# EAGLE design Digital In (EAGLE 5.11)
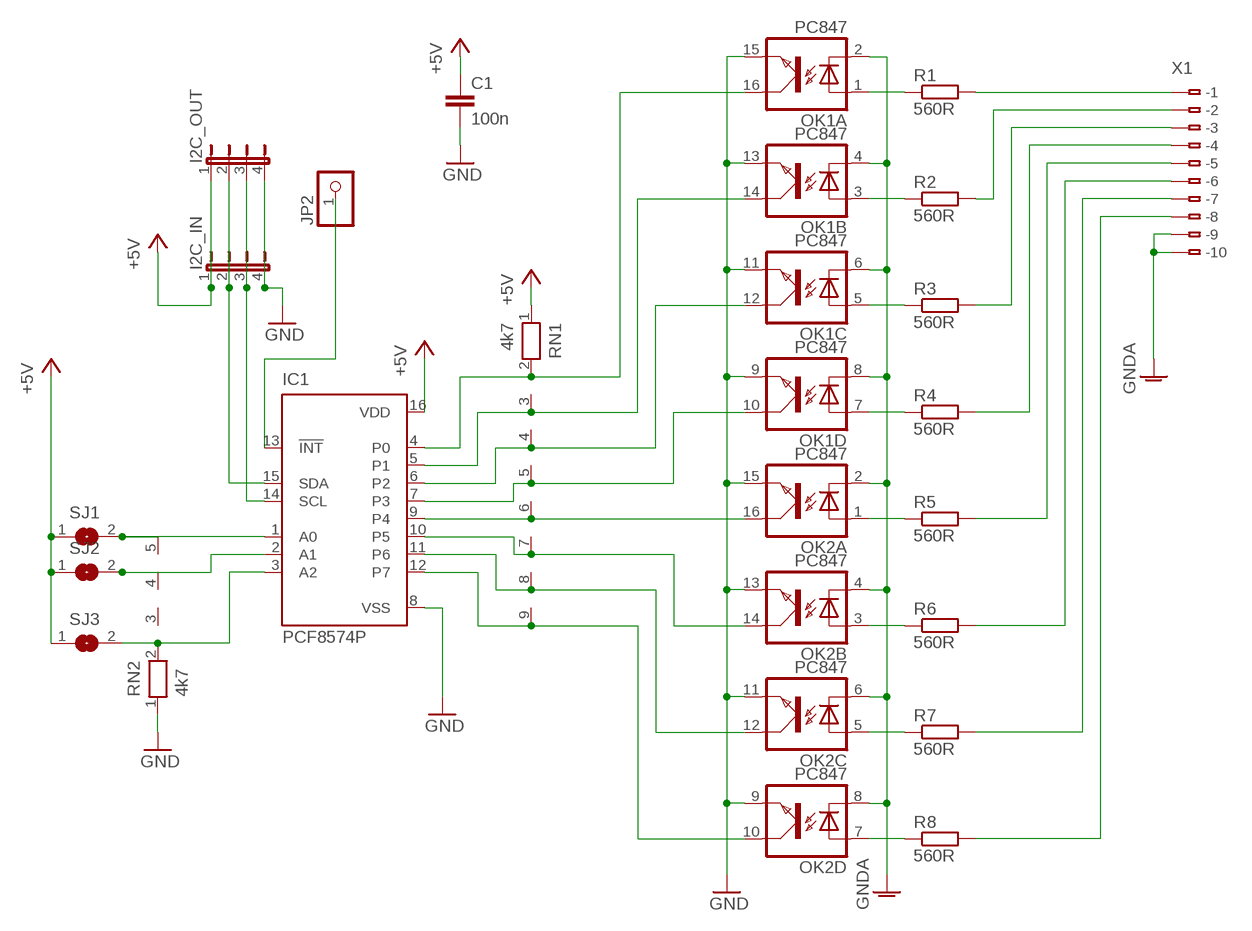
[diagram p0: schematic, sheet 1]

## Parts
C1  100n  C-EU050-030X075  [C050-030X075]
I2C_IN  JP4E  [JP4]
I2C_OUT  JP4E  [JP4]
IC1  PCF8574P  [DIL16]
JP2  PINHD-1X1  [1X01]
OK1  PC847  [DIL16]
OK2  PC847  [DIL16]
R1  560R  R-EU_0207/10  [0207/10]
R2  560R  R-EU_0207/10  [0207/10]
R3  560R  R-EU_0207/10  [0207/10]
R4  560R  R-EU_0207/10  [0207/10]
R5  560R  R-EU_0207/10  [0207/10]
R6  560R  R-EU_0207/10  [0207/10]
R7  560R  R-EU_0207/10  [0207/10]
R8  560R  R-EU_0207/10  [0207/10]
RN1  4k7  RN08  [RN-9]
RN2  4k7  RN04  [RN-5]
SJ1  SJW  [SJW]
SJ2  SJW  [SJW]
SJ3  SJW  [SJW]
X1  250-210  [250-210]

## Nets
+5V: C1.1 I2C_IN.1 I2C_OUT.1 IC1.16(VDD) RN1.1 SJ1.1 SJ2.1 SJ3.1
GND: C1.2 I2C_IN.4 I2C_OUT.4 IC1.8(VSS) OK1.9(D:EMIT) OK1.11(C:EMIT) OK1.13(B:EMIT) OK1.15(A:EMIT) OK2.9(D:EMIT) OK2.11(C:EMIT) OK2.13(B:EMIT) OK2.15(A:EMIT) RN2.1
GNDA: OK1.2(A:C) OK1.4(B:C) OK1.6(C:C) OK1.8(D:C) OK2.2(A:C) OK2.4(B:C) OK2.6(C:C) OK2.8(D:C) X1.A9(-9) X1.B10(-10)
N$1: IC1.9(P4) OK2.16(A:COL) RN1.6
N$2: IC1.7(P3) OK1.10(D:COL) RN1.5
N$3: IC1.6(P2) OK1.12(C:COL) RN1.4
N$4: IC1.5(P1) OK1.14(B:COL) RN1.3
N$5: IC1.4(P0) OK1.16(A:COL) RN1.2
N$6: IC1.10(P5) OK2.14(B:COL) RN1.7
N$7: IC1.11(P6) OK2.12(C:COL) RN1.8
N$8: IC1.12(P7) OK2.10(D:COL) RN1.9
N$9: IC1.13(!INT) JP2.1
N$10: IC1.3(A2) RN2.2 SJ3.2
N$11: IC1.2(A1) RN2.4 SJ2.2
N$12: IC1.1(A0) RN2.5 SJ1.2
N$14: I2C_IN.2 I2C_OUT.2 IC1.15(SDA)
N$15: I2C_IN.3 I2C_OUT.3 IC1.14(SCL)
N$16: OK1.1(A:A) R1.1
N$17: OK1.3(B:A) R2.1
N$18: OK1.5(C:A) R3.1
N$19: OK1.7(D:A) R4.1
N$20: OK2.1(A:A) R5.1
N$21: OK2.3(B:A) R6.1
N$22: OK2.5(C:A) R7.1
N$23: OK2.7(D:A) R8.1
N$24: R1.2 X1.A1(-1)
N$25: R2.2 X1.B2(-2)
N$26: R3.2 X1.A3(-3)
N$27: R4.2 X1.B4(-4)
N$28: R5.2 X1.A5(-5)
N$29: R6.2 X1.B6(-6)
N$30: R7.2 X1.A7(-7)
N$31: R8.2 X1.B8(-8)
Unconnected: RN2.3

## Library data of the parts
C1 = resistor:C-EU: CAPACITOR, European symbol
I2C_IN I2C_OUT = jumper:JP4E: JUMPER
IC1 = micro-philips:PCF8574: I2C-Bus Remote 8-bit I/O expander http://www.semiconductors.philips.com/acrobat_download/datasheets/PCF8574_4.pdf; MPN: PCF8574PN; OC_FARNELL: 204020; OC_NEWARK: 11N8515
JP2 = pinhead:PINHD-1X1: PIN HEADER
OK1 OK2 = optocoupler:PC847: SHARP OPTO COUPLER; OC_FARNELL: 9707735; OC_NEWARK: unknown
R1-R8 = resistor:R-EU_: RESISTOR, European symbol
RN1 = resistor-net:RN08: RESISTOR NETWORK; OC_FARNELL: unknown; OC_NEWARK: unknown
RN2 = resistor-net:RN04: RESISTOR NETWORK; OC_FARNELL: unknown; OC_NEWARK: unknown
SJ1-SJ3 = jumper:SJ: SMD solder JUMPER
X1 = Benjamin:250-210: WAGO Cage Clamp; MPN: 233-110; OC_FARNELL: unknown; OC_NEWARK: 28K9052

## Board
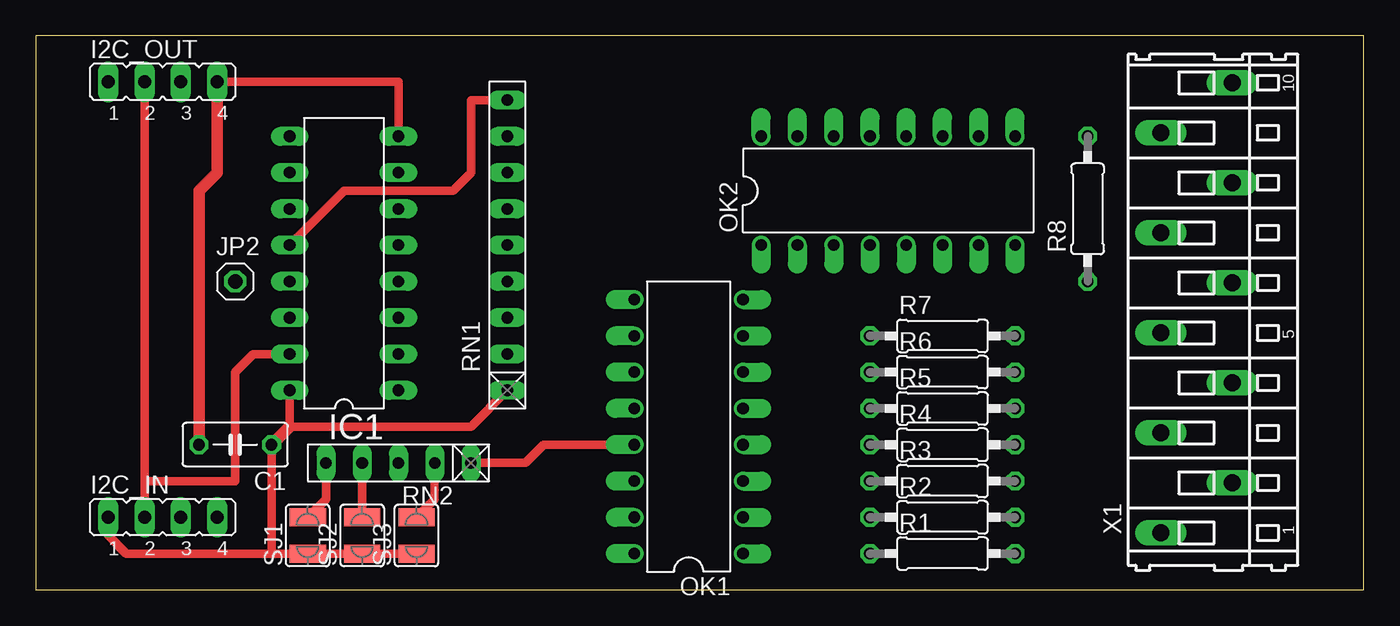
[diagram p1: board, top side]
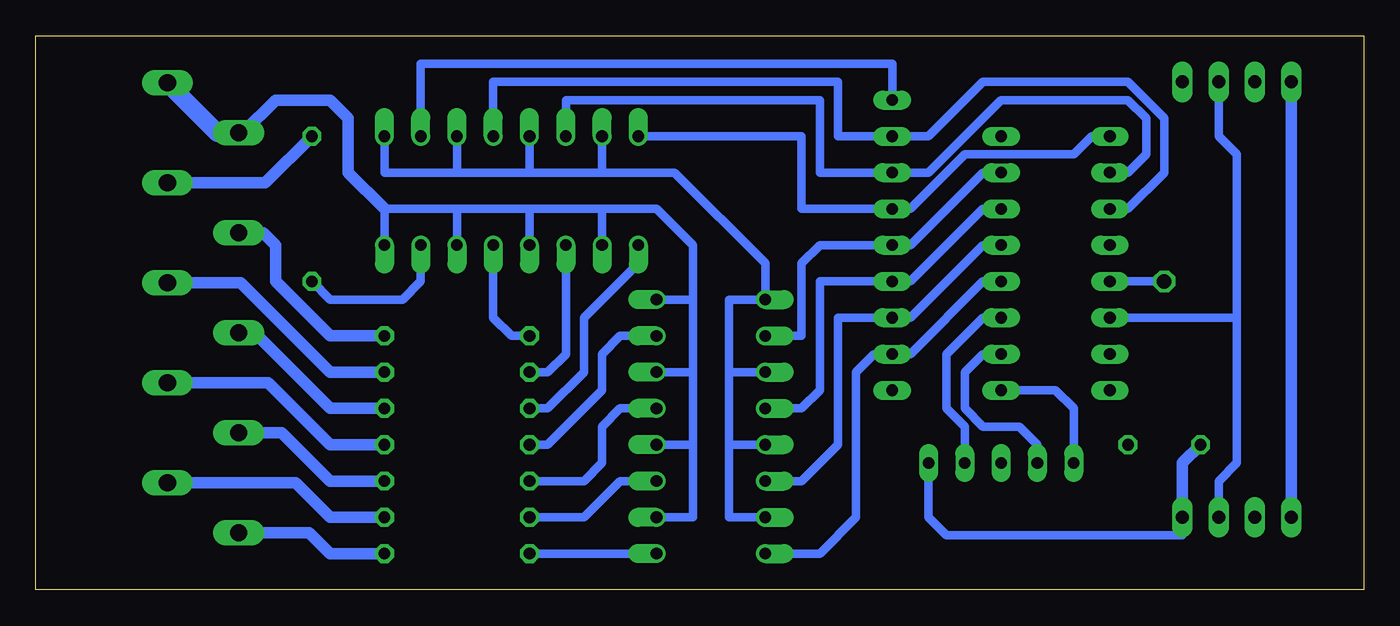
[diagram p2: board, bottom side, seen from below]

Size 93 x 38.79 mm. Coordinates in mm from the lower left corner, seen from the top.
Outline: 0,0 93,0 93,38.79 0,38.79 0,0
Copper layers (1*16): Top 0.035mm / dielectric 1.5mm / Bottom 0.035mm
Design rules "default": minimum track width 10mil, minimum drill 24mil, track to track 8mil, track to pad 8mil, pad to pad 8mil, via to via 8mil, smd to smd 8mil, copper to edge 40mil, drill to drill 8mil, minimum pad ring 10mil, minimum via ring 8mil, stop-mask expansion 4mil, vias tented up to drill 0mil, thermal gap 10mil

### Footprints (pad centres in the part's own frame; a part is rotated, then mirrored left to right if it is on the bottom)
C050-030X075 = drill 0.813 octagon: 1 -2.54,0; 2 2.54,0
JP4 = drill 0.914 long: 1 -3.81,0; 2 -1.27,0; 3 1.27,0; 4 3.81,0
DIL16 = drill 0.813 long: 1 -8.89,-3.81; 2 -6.35,-3.81; 3 -3.81,-3.81; 4 -1.27,-3.81; 5 1.27,-3.81; 6 3.81,-3.81; 7 6.35,-3.81; 8 8.89,-3.81; 9 8.89,3.81; 10 6.35,3.81; 11 3.81,3.81; 12 1.27,3.81; 13 -1.27,3.81; 14 -3.81,3.81; 15 -6.35,3.81; 16 -8.89,3.81
1X01 = drill 1.016 octagon: 1 0,0
DIL16' = drill 0.813 offset: 1 -8.89,-3.81; 2 -6.35,-3.81; 3 -3.81,-3.81; 4 -1.27,-3.81; 5 1.27,-3.81; 6 3.81,-3.81; 7 6.35,-3.81; 8 8.89,-3.81; 9 8.89,3.81; 10 6.35,3.81; 11 3.81,3.81; 12 1.27,3.81; 13 -1.27,3.81; 14 -3.81,3.81; 15 -6.35,3.81; 16 -8.89,3.81
0207/10 = drill 0.813 octagon: 1 -5.08,0; 2 5.08,0
RN-9 = drill 0.813 long: 1 -10.16,0; 2 -7.62,0; 3 -5.08,0; 4 -2.54,0; 5 0,0; 6 2.54,0; 7 5.08,0; 8 7.62,0; 9 10.16,0
RN-5 = drill 0.813 long: 1 -5.08,0; 2 -2.54,0; 3 0,0; 4 2.54,0; 5 5.08,0
SJW = smd 1.27 x 2.54: 1 -1.27,0; 2 1.27,0
250-210 = drill 1.2 long: A1 -11.25,2.5; A3 -4.25,2.5; A5 2.75,2.5; A7 9.75,2.5; A9 16.75,2.5; B2 -7.75,-2.5; B4 -0.75,-2.5; B6 6.25,-2.5; B8 13.25,-2.5; B10 20.25,-2.5

### Placement (x,y rotation side)
C1  13.97,10.16 180 top
I2C_IN  8.89,5.08 0 top
I2C_OUT  8.89,35.56 0 top
IC1  21.59,22.86 90 top
JP2  13.97,21.59 0 top
OK1  PC847  [DIL16']  45.72,11.43 90 top
OK2  PC847  [DIL16']  59.69,27.94 0 top
R1  63.5,2.54 0 top
R2  63.5,5.08 0 top
R3  63.5,7.62 0 top
R4  63.5,10.16 0 top
R5  63.5,12.7 0 top
R6  63.5,15.24 0 top
R7  63.5,17.78 0 top
R8  73.66,26.67 90 top
RN1  33.02,24.13 90 top
RN2  25.4,8.89 180 top
SJ1  19.05,3.81 90 top
SJ2  22.86,3.81 90 top
SJ3  26.67,3.81 90 top
X1  81.28,15.24 90 top

### Tracks (layer width: path | path; a pad name or v marks a point on that pad's centre or on a via)
+5V
  Top 0.61: IC1.16 17.78,11.43 30.48,11.43 RN1.1 | I2C_IN.1 5.08,3.81 6.35,2.54 16.51,2.54 | 16.51,2.54 SJ1.1 SJ2.1 SJ3.1 | 16.51,2.54 C1.1
  Top 0.813: C1.1 17.78,11.43
  Bottom 0.813: I2C_IN.1 I2C_OUT.1
GND
  Top 0.61: RN2.1 34.29,8.89 35.56,10.16 OK1.13 | IC1.8 25.4,35.56 I2C_OUT.4
  Top 0.813: I2C_OUT.4 12.7,29.21 11.43,27.94 C1.2
  Bottom 0.61: OK2.9 68.58,29.21 63.5,29.21 | 63.5,29.21 OK2.11 | 58.42,29.21 63.5,29.21 | 58.42,29.21 OK2.13 | 53.34,29.21 58.42,29.21 | 53.34,29.21 OK2.15 | OK1.15 44.45,5.08 44.45,10.16 | OK1.13 44.45,10.16 | 44.45,10.16 44.45,15.24 | 44.45,15.24 OK1.11 | 44.45,15.24 44.45,20.32 OK1.9 41.91,22.86 48.26,29.21 53.34,29.21 | RN2.1 30.48,5.08 29.21,3.81 12.7,3.81 I2C_IN.4
  Bottom 0.813: I2C_IN.4 12.7,8.89 C1.2
GNDA
  Bottom 0.61: OK1.2 46.99,5.08 46.99,10.16 | 46.99,10.16 OK1.4 | 46.99,15.24 OK1.6 | 46.99,10.16 46.99,15.24 | 46.99,20.32 OK1.8 | 46.99,15.24 46.99,20.32 | OK2.8 68.58,26.67 63.5,26.67 | 63.5,26.67 OK2.6 | 58.42,26.67 63.5,26.67 | 58.42,26.67 OK2.4 | 53.34,26.67 58.42,26.67 | 53.34,26.67 OK2.2 | 46.99,20.32 46.99,24.13 49.53,26.67 53.34,26.67
  Bottom 0.813: 68.58,26.67 71.12,29.21 71.12,33.02 72.39,34.29 76.2,34.29 78.5,31.99 X1.A9
  Bottom 1.27: X1.A9 80.28,31.99 X1.B10
N$1
  Bottom 0.61: OK2.16 39.37,31.75 39.37,26.67 RN1.6 31.75,26.67 27.94,30.48 20.32,30.48 19.05,31.75 IC1.9
N$2
  Bottom 0.61: OK1.10 39.37,17.78 39.37,22.86 38.1,24.13 RN1.5 31.75,24.13 26.67,29.21 IC1.7
N$3
  Bottom 0.61: OK1.12 39.37,12.7 38.1,13.97 38.1,21.59 RN1.4 31.75,21.59 26.67,26.67 IC1.6
N$4
  Bottom 0.61: OK1.14 39.37,7.62 36.83,10.16 36.83,19.05 RN1.3 31.75,19.05 26.67,24.13 IC1.5
N$5
  Bottom 0.61: OK1.16 38.1,2.54 35.56,5.08 35.56,15.24 34.29,16.51 RN1.2 31.75,16.51 26.67,21.59 IC1.4
N$6
  Bottom 0.61: OK2.14 55.88,34.29 38.1,34.29 38.1,29.21 RN1.7 30.48,29.21 25.4,34.29 16.51,34.29 15.24,33.02 15.24,30.48 16.51,29.21 IC1.10
N$7
  Bottom 0.61: OK2.12 60.96,35.56 36.83,35.56 36.83,31.75 RN1.8 30.48,31.75 26.67,35.56 16.51,35.56 13.97,33.02 13.97,29.21 16.51,26.67 IC1.11
N$8
  Top 0.61: RN1.9 30.48,34.29 30.48,29.21 29.21,27.94 21.59,27.94 IC1.12
  Bottom 0.61: RN1.9 33.02,36.83 66.04,36.83 OK2.10
N$9
  Bottom 0.61: JP2.1 IC1.13
N$10
  Top 0.61: RN2.2 27.94,6.35 SJ3.2
  Bottom 0.61: IC1.3 26.67,19.05 29.21,16.51 29.21,12.7 27.94,11.43 RN2.2
N$11
  Top 0.61: SJ2.2 RN2.4
  Bottom 0.61: RN2.4 22.86,10.16 24.13,11.43 26.67,11.43 27.94,12.7 27.94,15.24 26.67,16.51 IC1.2
N$12
  Top 0.61: RN2.5 20.32,6.35 SJ1.2
  Bottom 0.61: IC1.1 21.59,13.97 20.32,12.7 RN2.5
N$14
  Top 0.61: I2C_IN.2 7.62,7.62 | 7.62,7.62 I2C_OUT.2 | IC1.15 15.24,16.51 13.97,15.24 13.97,7.62 12.7,7.62 7.62,7.62
N$15
  Bottom 0.61: I2C_IN.3 10.16,7.62 8.89,8.89 8.89,19.05 | 8.89,19.05 IC1.14 | I2C_OUT.3 10.16,31.75 8.89,30.48 8.89,19.05
N$16
  Bottom 0.61: OK1.1 R1.1
N$17
  Bottom 0.61: R2.1 54.61,5.08 52.07,7.62 OK1.3
N$18
  Bottom 0.61: R3.1 54.61,7.62 53.34,8.89 53.34,11.43 52.07,12.7 OK1.5
N$19
  Bottom 0.61: R4.1 57.15,10.16 53.34,13.97 53.34,16.51 52.07,17.78 OK1.7
N$20
  Bottom 0.61: R5.1 57.15,12.7 54.61,15.24 54.61,19.05 50.8,22.86 OK2.1
N$21
  Bottom 0.61: R6.1 57.15,15.24 55.88,16.51 OK2.3
N$22
  Bottom 0.61: R7.1 59.69,17.78 60.96,19.05 OK2.5
N$23
  Bottom 0.61: R8.1 72.39,20.32 67.31,20.32 66.04,21.59 OK2.7
N$24
  Bottom 0.813: X1.A1 73.84,3.99 72.39,2.54 R1.2
N$25
  Bottom 0.813: X1.B2 74.8,7.49 72.39,5.08 R2.2
N$26
  Bottom 0.813: X1.A3 75.76,10.99 72.39,7.62 R3.2
N$27
  Bottom 0.813: X1.B4 76.72,14.49 72.39,10.16 R4.2
N$28
  Bottom 0.813: X1.A5 77.68,17.99 72.39,12.7 R5.2
N$29
  Bottom 0.813: X1.B6 78.64,21.49 72.39,15.24 R6.2
N$30
  Bottom 0.813: X1.A7 77.06,24.99 76.2,24.13 76.2,21.59 72.39,17.78 R7.2
N$31
  Bottom 0.813: X1.B8 76.92,28.49 R8.2